# Altium schematic sheet NTC.SchDoc
size A4
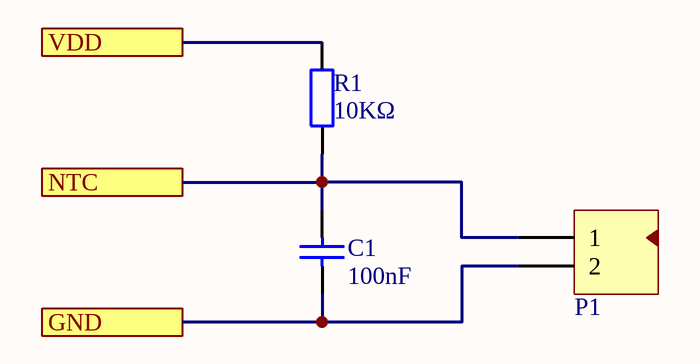
[diagram p0: NTC.SchDoc]

## Parts
C1  100nF  [LC-0603_C]
P1  Header 2  [1.27mm*2_via]  (value not drawn)
R1  10KΩ  [LC-0603_R]

## Ports
GND, NTC, VDD

## Nets
GND: C1.1 P1.2 ; port GND
NTC: C1.2 P1.1 R1.1 ; port NTC
VDD: R1.2 ; port VDD

## Library data of the parts
C1 = 0603 100nF (104) 10% 50V: 贴片电容; ComponentLink1Description: 供应商链接; ComponentLink1URL: http://www.szlcsc.com/product/details_15331.html; Package: 0603; Supplier: LC; SuppliersPartNumber: C14663
P1 = Header 2: 接插件; LatestRevisionDate: 17-Jul-2002; LatestRevisionNote: Re-released for DXP Platform.; Publisher: Altium Limited
R1 = 0603 10KΩ (1002) 1%: 贴片电阻; ComponentLink1Description: 供应商链接; ComponentLink1URL: http://www.szlcsc.com/product/details_26547.html; Package: 0603; Supplier: LC; SuppliersPartNumber: C25804